# EAGLE design Chime PCB (EAGLE 9.6.2)
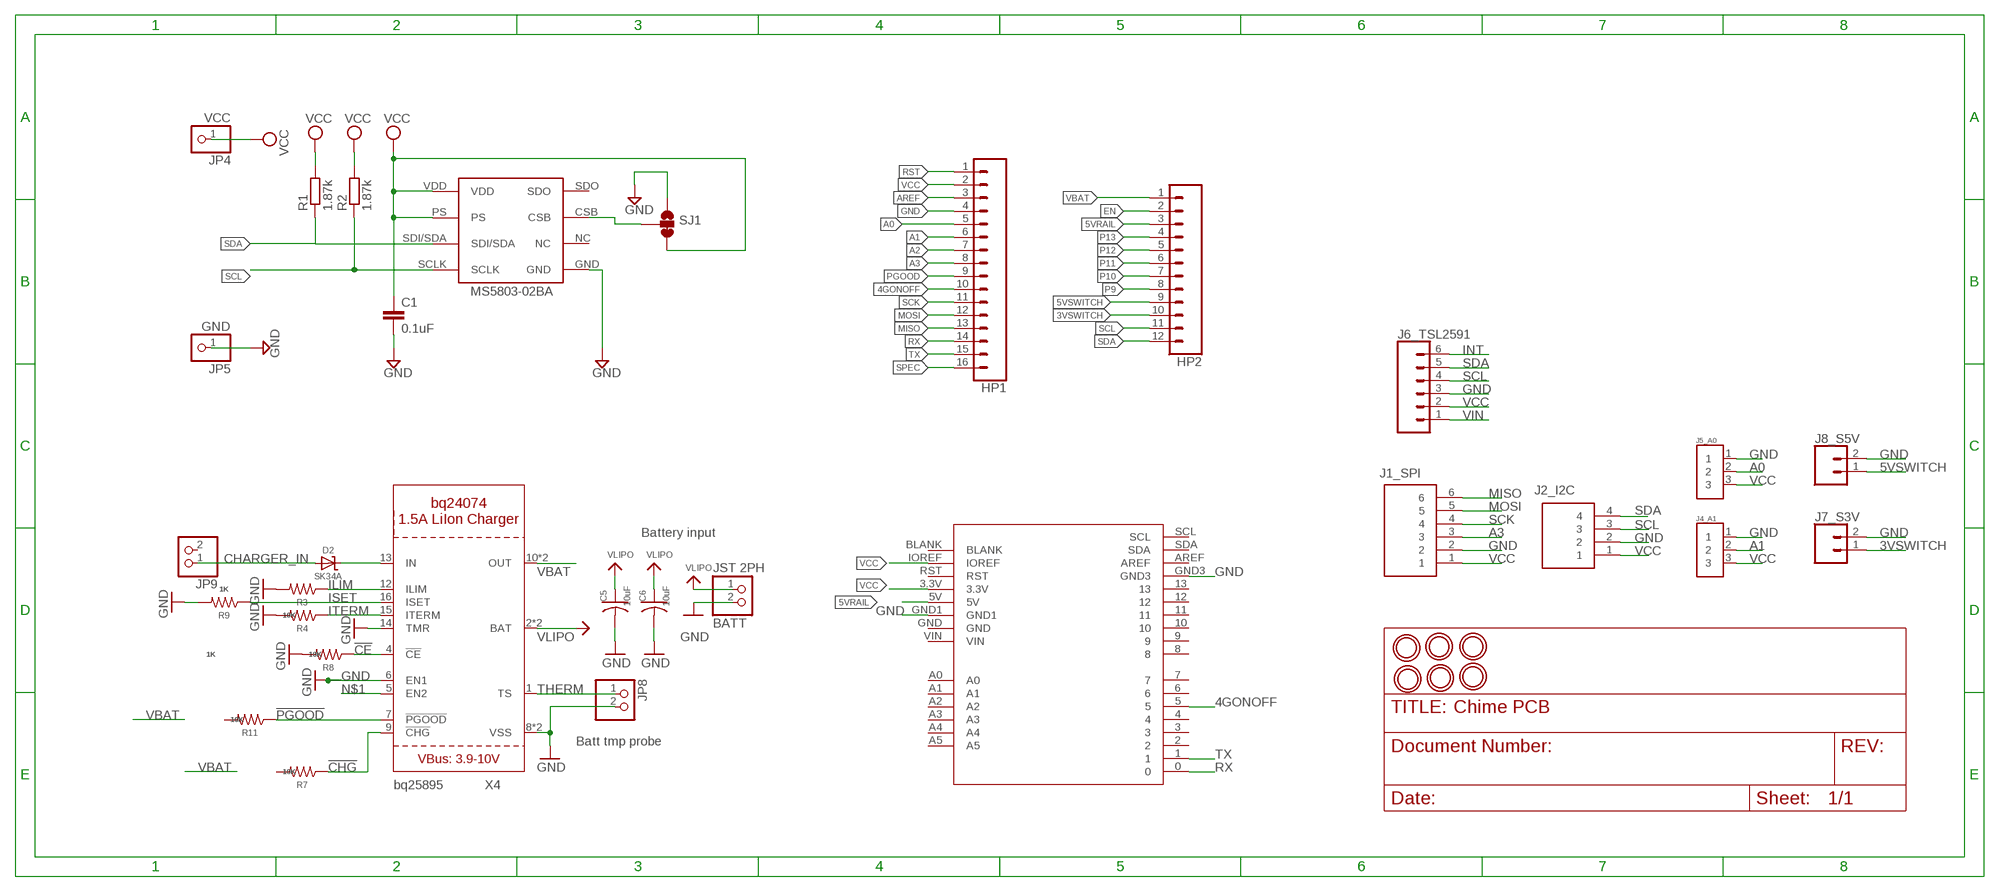
[diagram p0: schematic, sheet 1]

## Parts
BATT  JST 2PH  JST_2PIN-SMT-RA  [JST-PH-2-SMT-RA]
C1  0.1uF  C-EUC0805  [C0805]
C5  10uF  C-USC0805K  [C0805K]
C6  10uF  C-USC0805K  [C0805K]
D2  SK34A  DIODE-SCHOTTKYSMA  [SMADIODE]
HP1  CONN_16  [1X16]
HP2  CONN_12  [1X12]
J1_SPI  1725698  [1725698]
J2_I2C  1725672  [1725672]
J4_A1  282834-3  [TE_282834-3]
J5_A0  282834-3  [TE_282834-3]
J6_TSL2591  CONN_06LOCK  [1X06_LOCK]
J7_S3V  CONN_02  [1X02]
J8_S5V  CONN_02  [1X02]
JP4  VCC  PINHD-1X1  [1X01]
JP5  GND  PINHD-1X1  [1X01]
JP8  PINHD-1X2  [1X02]
JP9  PINHD-1X2  [1X02]
R1  1.87k  R-EU_R0805  [R0805]
R2  1.87k  R-EU_R0805  [R0805]
R3  1K  R-US_M0805  [M0805]
R4  10K  R-US_M0805  [M0805]
R7  10K  R-US_M0805  [M0805]
R8  10K  R-US_M0805  [M0805]
R9  1K  R-US_M0805  [M0805]
R11  10K  R-US_M0805  [M0805]
SJ1  JUMPER-SMT_3_1-NC_TRACE_SILK  [SMT-JUMPER_3_1-NC_TRACE_SILK]
U1  MS5803-02BA  [MS5803-02BA]
U$1  LTE_BOARD  [LTE_BOARD_FOOTPRINT]
U$2  MOUNTINGHOLE2.5  [MOUNTINGHOLE_2.5_PLATED]
U$3  MOUNTINGHOLE2.5  [MOUNTINGHOLE_2.5_PLATED]
U$4  MOUNTINGHOLE2.5  [MOUNTINGHOLE_2.5_PLATED]
U$5  MOUNTINGHOLE2.5  [MOUNTINGHOLE_2.5_PLATED]
U$17  MOUNTINGHOLE2.5  [MOUNTINGHOLE_2.5_PLATED]
U$19  MOUNTINGHOLE2.5  [MOUNTINGHOLE_2.5_PLATED]
X4  BQ24074  [QFN16_3MM]

## Nets
3VSWITCH: HP2.10 J7_S3V.1
4GONOFF: HP1.10 U$1.5
5VRAIL: HP2.3 U$1.5V
5VSWITCH: HP2.9 J8_S5V.1
!CE: R8.1 X4.4(!CE)
!CHG: R7.1 X4.9(!CHG)
!PGOOD: R11.1 X4.7(!PGOOD)
A0: HP1.5 J5_A0.2
A1: HP1.6 J4_A1.2
A2: HP1.7
A3: HP1.8 J1_SPI.3
AREF: HP1.3
CHARGER_IN: D2.A JP9.1
EN: HP2.2
GND: BATT.2 C1.2 C5.2 C6.2 HP1.4 J1_SPI.2 J2_I2C.2 J4_A1.1 J5_A0.1 J6_TSL2591.3 J7_S3V.2 J8_S5V.2 JP5.1 JP8.2 R3.2 R4.2 R8.2 R9.2 SJ1.1 U1.GND U$1.GND1 U$1.GND3 X4.6(EN1) X4.8(VSS) X4.14(TMR) X4.THERMAL(VSS)
ILIM: R3.1 X4.12(ILIM)
INT: J6_TSL2591.6
ISET: R9.1 X4.16(ISET)
ITERM: R4.1 X4.15(ITERM)
MISO: HP1.13 J1_SPI.6
MOSI: HP1.12 J1_SPI.5
N$1: X4.5(EN2)
N$2: D2.C X4.13(IN)
N$3: SJ1.2 U1.CSB
P9: HP2.8
P10: HP2.7
P11: HP2.6
P12: HP2.5
P13: HP2.4
PGOOD: HP1.9
RST: HP1.1
RX: HP1.14 U$1.0
SCK: HP1.11 J1_SPI.4
SCL: HP2.11 J2_I2C.3 J6_TSL2591.4 R2.1 U1.SCLK
SDA: HP2.12 J2_I2C.4 J6_TSL2591.5 R1.1 U1.SDI/SDA
SPEC: HP1.16
THERM: JP8.1 X4.1(TS)
TX: HP1.15 U$1.1
VBAT: HP2.1 X4.10(OUT) X4.11(OUT)
VCC: C1.1 HP1.2 J1_SPI.1 J2_I2C.1 J4_A1.3 J5_A0.3 J6_TSL2591.2 JP4.1 R1.2 R2.2 SJ1.3 U1.PS U1.VDD U$1.3.3V U$1.IOREF
VIN: J6_TSL2591.1
VLIPO: BATT.1 C5.1 C6.1 X4.2(BAT) X4.3(BAT)
Unconnected: JP9.2 R7.2 R11.2 U1.NC U1.SDO U$1.2 U$1.3 U$1.4 U$1.6 U$1.7 U$1.8 U$1.9 U$1.10 U$1.11 U$1.12 U$1.13 U$1.A0 U$1.A1 U$1.A2 U$1.A3 U$1.A4 U$1.A5 U$1.AREF U$1.BLANK U$1.GND U$1.RST U$1.SCL U$1.SDA U$1.VIN

## Notes on the sheet
- Battery input
- Batt tmp probe

## Library data of the parts
BATT = adafruit:JST_2PIN: JST 2-Pin Connectors of various flavors SMT-RA (S2B-PH-SM4) 4UConnector #17311 SMT (B2B-PH-SM4) THM-RA (S2B-PH) THM (B2B-PH)
C1 = rcl:C-EU: CAPACITOR, European symbol; SPICEPREFIX: C
C5 C6 = adafruit:C-US: CAPACITOR, American symbol
D2 = microbuilder:DIODE-SCHOTTKY
HP1 = SparkFun-Connectors:CONN_16: Multi connection point. Often used as Generic Header-pin footprint for 0.1 inch spaced/style header connections On any of the 0.1 inch spaced packages, you can populate with these: Break Away Headers - Straight <https://www.sparkfun.com/products/116> (PRT-00116) Break Away Male Headers - Right Angle <https://www.sparkfun.com/products/553> (PRT-00553) Female Headers <https://www.sparkfun.com/products/115> (PRT-00115) Break Away Headers - Machine Pin <https://www.sparkfun.com/products/117> (PRT-00117) Break Away Female Headers - Swiss Machine Pin <https://www.sparkfun.com/products/743> (PRT-00743) For SCREWTERMINALS and SPRING TERMINALS visit here: Screw Terimnals on SparkFun.com <https://www.sparkfun.com/search/results?term=Screw+Terminals> (5mm/3.5mm/2.54mm spacing) This device is also useful as a general connection point to wire up your design to another part of your project. Our various solder wires solder well into these plated through hole pads. Hook-Up Wire - Assortment (Stranded, 22 AWG) <https://www.sparkfun.com/products/11375> (PRT-11375) Hook-Up Wire - Assortment (Solid Core, 22 AWG) <https://www.sparkfun.com/products/11367> (PRT-11367) View the entire wire category on our website here <https://www.sparkfun.com/categories/141> Special notes: Molex polarized connector foot print use with SKU : PRT-08231 with associated crimp pins and housings. 1MM SMD Version SKU: PRT-10208 NOTES ON THE VARIANTS LOCK and LOCK_LONGPADS... This footprint was designed to help hold the alignment of a through-hole component (i.e. 6-pin header) while soldering it into place. You may notice that each hole has been shifted either up or down by 0.005 of an inch from it's more standard position (which is a perfectly straight line). This slight alteration caused the pins (the squares in the middle) to touch the edges of the holes. Because they are alternating, it causes a "brace" to hold the component in place. 0.005 has proven to be the perfect amount of "off-center" position when using our standard breakaway headers. Although looks a little odd when you look at the bare footprint, once you have a header in there, the alteration is very hard to notice. Also,if you push a header all the way into place, it is covered up entirely on the bottom side.
HP2 = SparkFun-Connectors:CONN_12: Multi connection point. Often used as Generic Header-pin footprint for 0.1 inch spaced/style header connections On any of the 0.1 inch spaced packages, you can populate with these: Break Away Headers - Straight <https://www.sparkfun.com/products/116> (PRT-00116) Break Away Male Headers - Right Angle <https://www.sparkfun.com/products/553> (PRT-00553) Female Headers <https://www.sparkfun.com/products/115> (PRT-00115) Break Away Headers - Machine Pin <https://www.sparkfun.com/products/117> (PRT-00117) Break Away Female Headers - Swiss Machine Pin <https://www.sparkfun.com/products/743> (PRT-00743) For SCREWTERMINALS and SPRING TERMINALS visit here: Screw Terimnals on SparkFun.com <https://www.sparkfun.com/search/results?term=Screw+Terminals> (5mm/3.5mm/2.54mm spacing) This device is also useful as a general connection point to wire up your design to another part of your project. Our various solder wires solder well into these plated through hole pads. Hook-Up Wire - Assortment (Stranded, 22 AWG) <https://www.sparkfun.com/products/11375> (PRT-11375) Hook-Up Wire - Assortment (Solid Core, 22 AWG) <https://www.sparkfun.com/products/11367> (PRT-11367) View the entire wire category on our website here <https://www.sparkfun.com/categories/141> Special notes: Molex polarized connector foot print use with SKU : PRT-08231 with associated crimp pins and housings. 1MM SMD Version SKU: PRT-10208 NOTES ON THE VARIANTS LOCK and LOCK_LONGPADS... This footprint was designed to help hold the alignment of a through-hole component (i.e. 6-pin header) while soldering it into place. You may notice that each hole has been shifted either up or down by 0.005 of an inch from it's more standard position (which is a perfectly straight line). This slight alteration caused the pins (the squares in the middle) to touch the edges of the holes. Because they are alternating, it causes a "brace" to hold the component in place. 0.005 has proven to be the perfect amount of "off-center" position when using our standard breakaway headers. Although looks a little odd when you look at the bare footprint, once you have a header in there, the alteration is very hard to notice. Also,if you push a header all the way into place, it is covered up entirely on the bottom side.
J1_SPI = 1725698:1725698: Conn PC Terminal Block 6 POS 2.54mm Solder ST Thru-Hole 6A Source: Datasheet <https://www.phoenixcontact.com/online/portal/us/pxc/product_detail_page/!ut/p/z1/5Vddc6IwFP0r7oNvxYSPBHhEdNda6-KKW-GFISE6tHwVUmn76zeonY7dVmfH8WEH5s6QhHtv7jnJYeYCHyyBn4WbeB3yOM_CRMw9Hwdu3x0OHQXLP2eoD68HyB5OtF_yaKqA38AHfsUSRjmL7JCzdV6-AM-aTJoPPCTAk5tRQekD8B>; ARROW_PART_NUMBER: 1725698; ARROW_PRICE-STOCK: https://www.arrow.com/en/products/1725698/phoenix-contact?region=nac; DESCRIPTION: Conn PC Terminal Block 6 POS 2.54mm Solder ST Thru-Hole 6A; HEIGHT: 8.65mm; MANUFACTURER_NAME: Phoenix Contact; MANUFACTURER_PART_NUMBER: 1725698; MOUSER_PART_NUMBER: 651-1725698; MOUSER_PRICE-STOCK: https://www.mouser.co.uk/ProductDetail/Phoenix-Contact/1725698?qs=Ul7CXFMnlWUIR3VpVwwC4A%3D%3D
J2_I2C = 1725672:1725672: 4 way vertical PCB terminal,6A 63V Phoenix Contact Non-Fused Terminal Block, 4 Way, Solder Terminals, 26 ??? 20 AWG Through Hole, Nylon, 63 V Source: Datasheet <https://datasheet.datasheetarchive.com/originals/distributors/SFDatasheet-2/sf-00050602.pdf>; ARROW_PART_NUMBER: 1725672; ARROW_PRICE-STOCK: https://www.arrow.com/en/products/1725672/phoenix-contact?region=nac; DESCRIPTION: 4 way vertical PCB terminal,6A 63V Phoenix Contact Non-Fused Terminal Block, 4 Way, Solder Terminals, 26 ??? 20 AWG Through Hole, Nylon, 63 V; HEIGHT: 8.65mm; MANUFACTURER_NAME: Phoenix Contact; MANUFACTURER_PART_NUMBER: 1725672; MOUSER_PART_NUMBER: 651-1725672; MOUSER_PRICE-STOCK: https://www.mouser.co.uk/ProductDetail/Phoenix-Contact/1725672?qs=Ul7CXFMnlWXX93F9bOV2pQ%3D%3D
J4_A1 J5_A0 = Fixed Terminal Blocks 3P:282834-3: Conn; Term Blk; PCB; Wire Receptacle; 3; 2.54mm; 30-16AWG; Green; 10A; 150V; M1.6 Check availability <https://pricing.snapeda.com/parts/282834-3/TE%20Connectivity/view-part?ref=eda>; AVAILABILITY: In Stock; COMMENT: 282834-3; DESCRIPTION: 3 Position Wire to Board Terminal Block Horizontal with Board 0.100 (2.54mm); EU_ROHS_COMPLIANCE: Compliant with Exemptions; MF: TE Connectivity; MP: 282834-3; PACKAGE: None; PRICE: None; PURCHASE-URL: https://pricing.snapeda.com/search/part/282834-3/?ref=eda
J6_TSL2591 = SparkFun-Connectors:CONN_06: Multi connection point. Often used as Generic Header-pin footprint for 0.1 inch spaced/style header connections On any of the 0.1 inch spaced packages, you can populate with these: Break Away Headers - Straight <https://www.sparkfun.com/products/116> (PRT-00116) Break Away Male Headers - Right Angle <https://www.sparkfun.com/products/553> (PRT-00553) Female Headers <https://www.sparkfun.com/products/115> (PRT-00115) Break Away Headers - Machine Pin <https://www.sparkfun.com/products/117> (PRT-00117) Break Away Female Headers - Swiss Machine Pin <https://www.sparkfun.com/products/743> (PRT-00743) Arduino Stackable Header - 6 Pin <https://www.sparkfun.com/products/9280> (PRT-09280) Screw Terminals 2.54mm Pitch (6-Pin) <https://www.sparkfun.com/products/16499> (PRT-16499) For SCREWTERMINALS and SPRING TERMINALS visit here: Screw Terimnals on SparkFun.com <https://www.sparkfun.com/search/results?term=Screw+Terminals> (5mm/3.5mm/2.54mm spacing) This device is also useful as a general connection point to wire up your design to another part of your project. Our various solder wires solder well into these plated through hole pads. Hook-Up Wire - Assortment (Stranded, 22 AWG) <https://www.sparkfun.com/products/11375> (PRT-11375) Hook-Up Wire - Assortment (Solid Core, 22 AWG) <https://www.sparkfun.com/products/11367> (PRT-11367) View the entire wire category on our website here <https://www.sparkfun.com/categories/141>
J7_S3V J8_S5V = SparkFun-Connectors:CONN_02: Multi connection point. Often used as Generic Header-pin footprint for 0.1 inch spaced/style header connections On any of the 0.1 inch spaced packages, you can populate with these: Break Away Headers - Straight <https://www.sparkfun.com/products/116> (PRT-00116) Break Away Male Headers - Right Angle <https://www.sparkfun.com/products/553> (PRT-00553) Female Headers <https://www.sparkfun.com/products/115> (PRT-00115) Break Away Headers - Machine Pin <https://www.sparkfun.com/products/117> (PRT-00117) Break Away Female Headers - Swiss Machine Pin <https://www.sparkfun.com/products/743> (PRT-00743) For SCREWTERMINALS and SPRING TERMINALS visit here: Screw Terimnals on SparkFun.com <https://www.sparkfun.com/search/results?term=Screw+Terminals> (5mm/3.5mm/2.54mm spacing) This device is also useful as a general connection point to wire up your design to another part of your project. Our various solder wires solder well into these plated through hole pads. Hook-Up Wire - Assortment (Stranded, 22 AWG) <https://www.sparkfun.com/products/11375> (PRT-11375) Hook-Up Wire - Assortment (Solid Core, 22 AWG) <https://www.sparkfun.com/products/11367> (PRT-11367) View the entire wire category on our website here <https://www.sparkfun.com/categories/141> Special notes: Molex polarized connector foot print use with: PRT-08233 with associated crimp pins and housings. 2.54_SCREWTERM for use with PRT-10571. 3.5mm Screw Terminal footprints for PRT-08084 5mm Screw Terminal footprints for use with PRT-08432
JP4 JP5 = pinhead_simple:PINHD-1X1: PIN HEADER
JP8 JP9 = pinhead:PINHD-1X2: PIN HEADER
R1 R2 = rcl:R-EU_: RESISTOR, European symbol; SPICEPREFIX: R
R3 R4 R7-R9 R11 = adafruit:R-US_: RESISTOR, American symbol
SJ1 = SparkFun-Jumpers:JUMPER-SMT_3_1-NC_TRACE: Normally closed trace jumper (1 of 2 connections) This jumper has a trace between two pads so it's normally closed (NC). The other connection is normally open (NO). Use a razor knife to open the connection. For best results follow the IPC guidelines for cutting traces: Cutout at least 0.063 mm (0.005 in). Remove all loose material to clean up the cut area. Seal the cut with an approved epoxy. Reapply solder to reclose the connection, or to close the NO connection.
U1 = PNNL_Probe:MS5803-02BA
U$1 = LTE_BOARD_LOOM:LTE_BOARD: LTE_BOARD
U$2-U$5 U$17 U$19 = microbuilder:MOUNTINGHOLE: Mounting Hole For #2 screws (0.086"/2.18mm width, 0.094"/2.4mm hole) use 2.5mm; BOM: EXCLUDE
X4 = adafruit_power:BQ24074

## Board
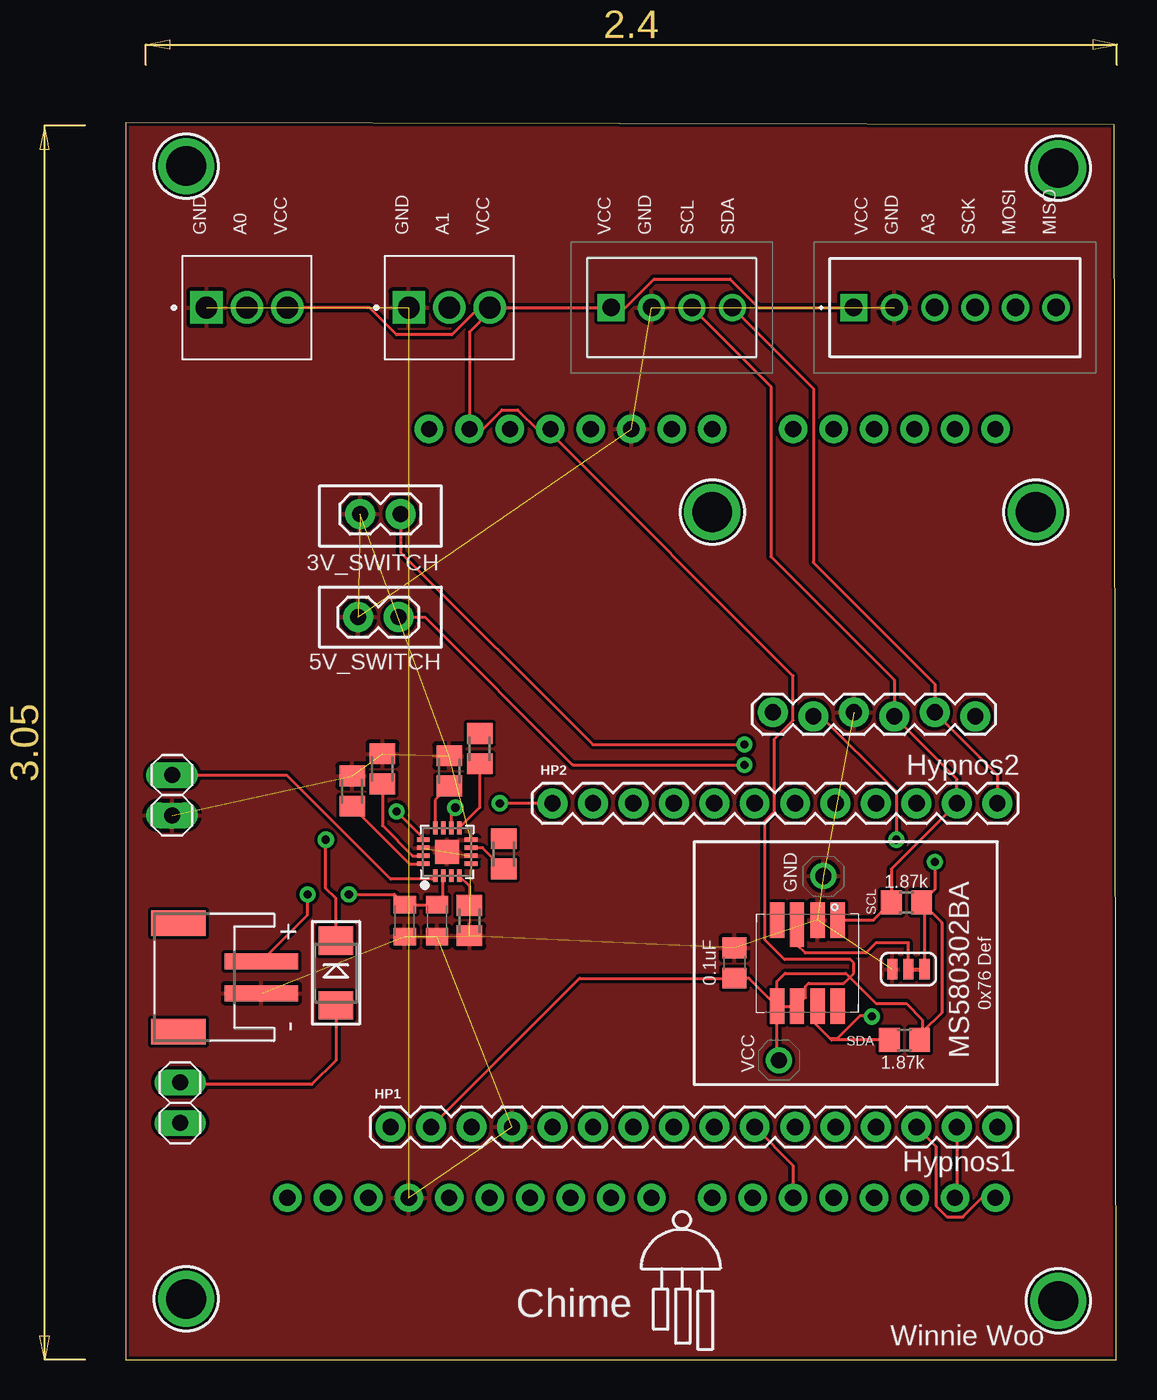
[diagram p1: board, top side]
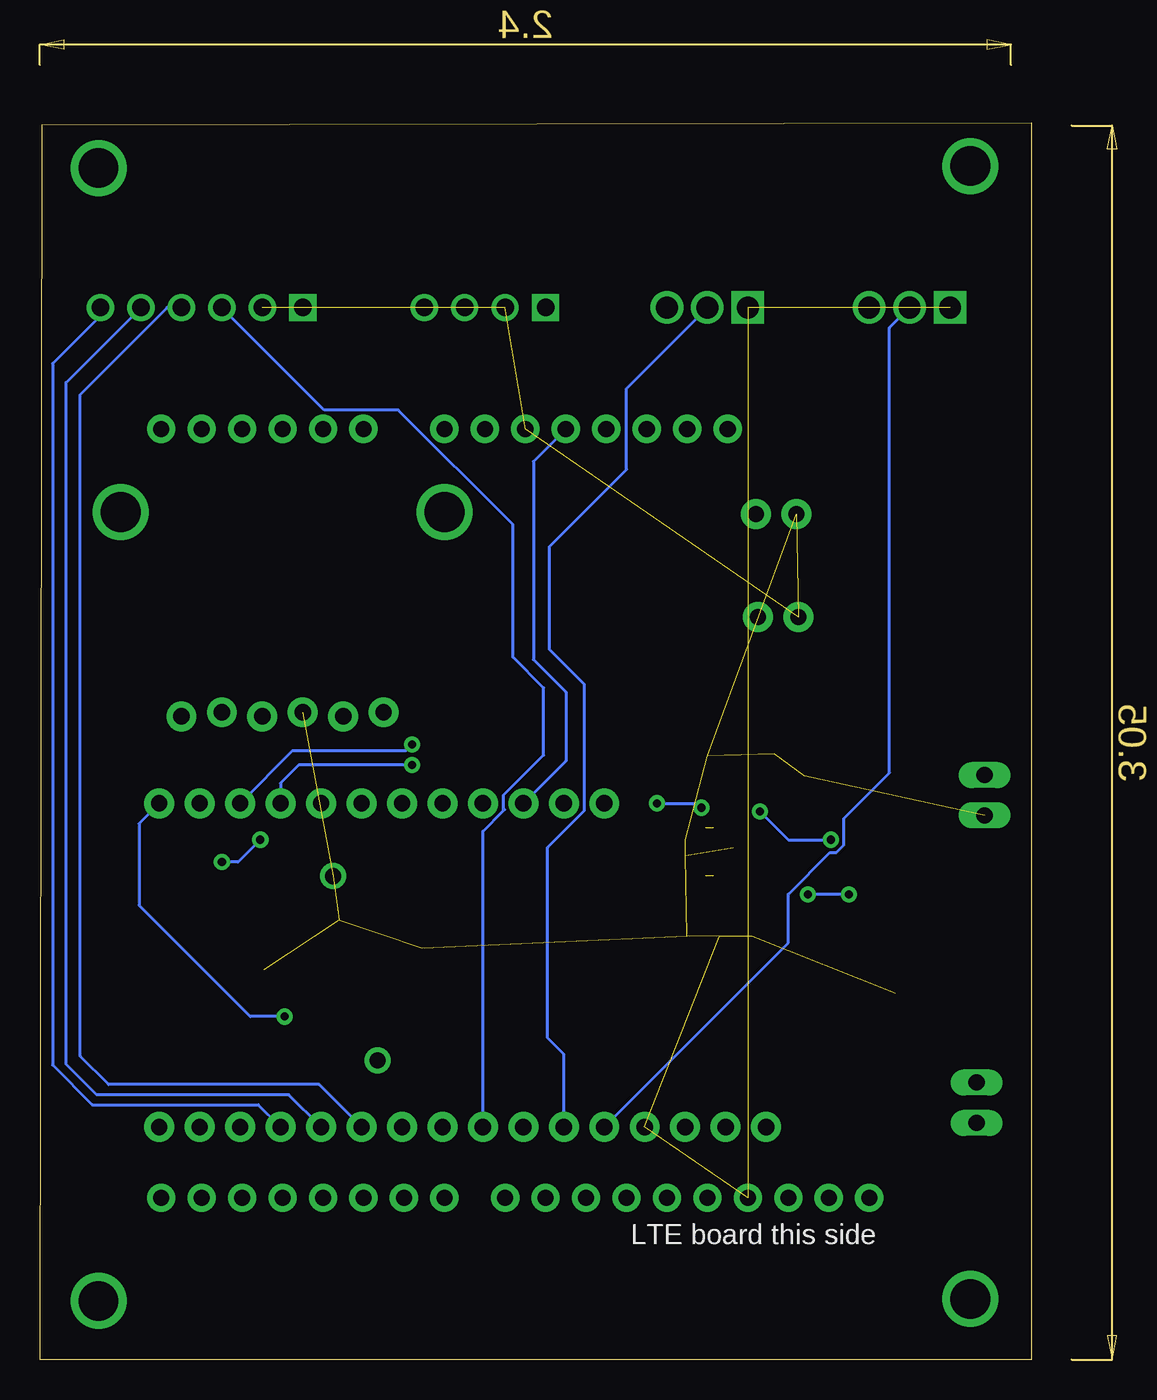
[diagram p2: board, bottom side, seen from below]

Size 62.21 x 77.65 mm. Coordinates in mm from the lower left corner, seen from the top.
Outline: 0,0 62.21,0 62.08,77.52 0,77.65 0,0
Copper layers (1*16): Top 0.035mm / dielectric 1.5mm / Bottom 0.035mm
Design rules "SparkFun": minimum track width 8mil, minimum drill 20mil, track to track 8mil, track to pad 8mil, pad to pad 8mil, via to via 8mil, smd to smd 8mil, copper to edge 8mil, drill to drill 8mil, minimum pad ring 12mil, minimum via ring 10mil, stop-mask expansion 4mil, vias tented up to drill 20mil, thermal gap 10mil

### Footprints (pad centres in the part's own frame; a part is rotated, then mirrored left to right if it is on the bottom)
JST-PH-2-SMT-RA = smd 1 x 4.6: 1 1,-3.7; 2 -1,-3.7 | smd 1.6 x 3.4: NC1 -3.4,1.5; NC2 3.4,1.5
C0805 = smd 1.3 x 1.5: 1 -0.95,0; 2 0.95,0
C0805K = smd 1.1 x 1.4: 1 -1,0; 2 1,0
SMADIODE = smd 1.778 x 2.159: A 2.019,0; C -2.045,0
1X16 = drill 1.016 pad 1.88: 1 0,0; 2 2.54,0; 3 5.08,0; 4 7.62,0; 5 10.16,0; 6 12.7,0; 7 15.24,0; 8 17.78,0; 9 20.32,0; 10 22.86,0; 11 25.4,0; 12 27.94,0; 13 30.48,0; 14 33.02,0; 15 35.56,0; 16 38.1,0
1X12 = drill 1.016 pad 1.88: 1 0,0; 2 2.54,0; 3 5.08,0; 4 7.62,0; 5 10.16,0; 6 12.7,0; 7 15.24,0; 8 17.78,0; 9 20.32,0; 10 22.86,0; 11 25.4,0; 12 27.94,0
1725698 = drill 1.1 pad 1.65 square: 1 0,0 | drill 1.1 pad 1.65: 2 2.54,0; 3 5.08,0; 4 7.62,0; 5 10.16,0; 6 12.7,0
1725672 = drill 1.1 pad 1.65 square: 1 0,0 | drill 1.1 pad 1.65: 2 2.54,0; 3 5.08,0; 4 7.62,0
TE_282834-3 = drill 1.36 square: 1 0,0 | drill 1.36: 2 2.54,0; 3 5.08,0
1X06_LOCK = drill 1.016 pad 1.88: 1 0,0; 2 2.54,-0.254; 3 5.08,0; 4 7.62,-0.254; 5 10.16,0; 6 12.7,-0.254
1X02 = drill 1.016 pad 1.88: 1 0,0; 2 2.54,0
1X01 = drill 1.016: 1 0,0
1X02' = drill 1.016 long: 1 -1.27,0; 2 1.27,0
R0805 = smd 1.3 x 1.5: 1 -0.95,0; 2 0.95,0
M0805 = smd 1.3 x 1.6: 1 -0.95,0; 2 0.95,0
SMT-JUMPER_3_1-NC_TRACE_SILK = smd 0.635 x 1.27: 1 -1.016,0; 2 0,0; 3 1.016,0
MS5803-02BA = smd 2.8 x 0.9: CSB 2.42,0.65 | smd 2.25 x 0.9: GND 2.7,-0.65; NC 2.7,1.9; PS -2.7,0.65; SCLK 2.7,-1.9; SDI/SDA -2.7,-0.65; SDO -2.7,-1.9; VDD -2.7,1.9
LTE_BOARD_FOOTPRINT = drill 1.016 pad 1.778: 0 35.56,48.26; 1 33.02,48.26; 2 30.48,48.26; 3 27.94,48.26; 3.3V 7.62,0; 4 25.4,48.26; 5 22.86,48.26; 5V 10.16,0; 6 20.32,48.26; 7 17.78,48.26; 8 13.97,48.26; 9 11.43,48.26; 10 8.89,48.26; 11 6.35,48.26; 12 3.81,48.26; 13 1.27,48.26; A0 22.86,0; A1 25.4,0; A2 27.94,0; A3 30.48,0; A4 33.02,0; A5 35.56,0; AREF -3.81,48.26; BLANK 0,0; GND 15.24,0; GND1 12.7,0; GND3 -1.27,48.26; IOREF 2.54,0; RST 5.08,0; SCL -8.89,48.26; SDA -6.35,48.26; VIN 17.78,0
MOUNTINGHOLE_2.5_PLATED = drill 2.5 pad 3.2: P$1 0,0
QFN16_3MM = smd 0.8 x 0.28: 1 -1.5,0.75; 2 -1.5,0.25; 3 -1.5,-0.25; 4 -1.5,-0.75; 9 1.5,-0.75; 10 1.5,-0.25; 11 1.5,0.25; 12 1.5,0.75 | smd 0.28 x 0.8: 5 -0.75,-1.5; 6 -0.25,-1.5; 7 0.25,-1.5; 8 0.75,-1.5; 13 0.75,1.5; 14 0.25,1.5; 15 -0.25,1.5; 16 -0.75,1.5 | smd 1.5 x 1.5: THERMAL 0,0

### Placement (x,y rotation side)
BATT  4.83,24 90 top
C1  38.23,24.89 90 top
C5  19.56,27.56 270 top
C6  17.53,27.56 270 top
D2  13.21,24.26 270 top
HP1  16.64,14.61 0 top
HP2  26.8,34.92 0 top
J1_SPI  45.72,66.04 0 top
J2_I2C  30.48,66.04 0 top
J4_A1  17.78,66.04 0 top
J5_A0  5.08,66.04 0 top
J6_TSL2591  40.64,40.64 0 top
J7_S3V  17.27,53.09 180 top
J8_S5V  17.14,46.61 180 top
JP4  41.02,18.8 90 top
JP5  43.81,30.35 90 top
JP8  [1X02']  2.92,35.43 270 top
JP9  [1X02']  3.43,16.13 270 top
R1  48.9,20.07 0 top
R2  49.02,28.7 0 top
R3  20.32,36.96 90 top
R4  16.13,37.08 90 top
R7  22.23,38.35 90 top
R8  21.59,27.56 270 top
R9  14.22,35.69 90 top
R11  23.75,31.75 90 top
SJ1  49.15,24.51 0 top
U1  42.8,24.89 90 top
U$1  19.05,58.42 180 bottom
U$2  3.81,3.81 0 top
U$3  3.81,74.93 0 top
U$4  58.55,74.8 0 top
U$5  58.55,3.68 0 top
U$17  57.15,53.21 0 top
U$19  36.83,53.21 0 top
X4  20.19,31.88 90 top

### Tracks (layer width: path | path; a pad name or v marks a point on that pad's centre or on a via)
3VSWITCH  (via drill 0.51)
  Top 0.203: J7_S3V.1 17.27,50.67 29.34,38.61 v38.86,38.61
  Bottom 0.203: v38.86,38.61 39.24,38.23 46.35,38.23 HP2.10
4GONOFF
  Top 0.203: HP1.10 41.91,12.19 U$1.5
5VRAIL
  Bottom 0.203: HP2.3 29.21,37.59 29.21,41.91 31.24,43.94 31.24,56.39 U$1.5V
5VSWITCH  (via drill 0.51)
  Top 0.203: J8_S5V.1 18.8,46.61 28.07,37.34 v38.86,37.34
  Bottom 0.203: v38.86,37.34 45.97,37.34 47.12,36.2 HP2.9
!CE
  Top 0.203: X4.4 21.59,29.73 R8.1
!CHG
  Top 0.203: R7.1 22.23,34.66 X4.9
!PGOOD
  Top 0.203: R11.1 22.42,32.13 X4.7
A0
  Bottom 0.203: J5_A0.2 8.89,64.77 8.89,36.83 11.76,33.96 11.76,32.3 12.24,31.83 12.62,31.83 15.24,29.21 15.24,26.16 HP1.5
A1
  Bottom 0.203: J4_A1.2 25.4,60.96 25.4,55.88 30.23,51.05 30.23,44.58 28.04,42.39 28.04,34.46 30.35,32.15 30.35,20.19 29.34,19.18 HP1.6
A3
  Bottom 0.203: HP1.8 34.42,33.16 33.12,34.46 | J1_SPI.3 44.37,59.61 39.73,59.61 32.54,52.42 32.54,44.09 30.61,42.16 30.61,37.95 33.12,35.44 33.12,34.46 | 33.12,34.46 33.05,34.54
CHARGER_IN
  Top 0.203: JP9.1 3.56,17.27 11.68,17.27 13.21,18.8 D2.A
GND  (25 unrouted)
  pour Top: 0,77.47 62.23,77.47 62.23,0 0,0
ILIM
  Top 0.203: R3.1 19.44,35.13 X4.12
ISET
  Top 0.203: R9.1 17.83,31.13 X4.16
ITERM
  Top 0.203: R4.1 16.13,33.53 18.04,31.63 X4.15
MISO
  Bottom 0.203: J1_SPI.6 58.42,65.53 61.43,62.52 61.43,18.5 58.93,16 48.51,16 HP1.13
MOSI
  Bottom 0.203: HP1.12 46.61,16.64 58.67,16.64 60.58,18.54 60.58,61.34 J1_SPI.5
N$2  (via drill 0.51)
  Top 0.203: v17.02,34.42 18.69,32.74 X4.13 | D2.C 13.21,28.96 12.57,29.59 v12.57,32.64
  Bottom 0.203: v17.02,34.42 15.24,32.64 v12.57,32.64
N$3
  Top 0.203: U1.CSB 42.15,26.05 42.67,25.53 46.48,25.53 47.12,26.16 49.15,26.16 SJ1.2
RX
  Top 0.203: HP1.14 50.88,13.39 50.88,9.67 51.58,8.97 52.56,8.97 53.76,10.16 U$1.0
SCK
  Bottom 0.203: HP1.11 44.7,17.27 57.91,17.27 59.69,19.05 59.69,60.59 54.24,66.04 J1_SPI.4
SCL
  Top 0.203: U1.SCLK 46.96,27.59 R2.1 48.07,30.8 HP2.11 52.2,36.45 J6_TSL2591.4 48.26,42.65 40.51,50.4 40.51,61.09 J2_I2C.3
SDA  (via drill 0.51)
  Top 0.203: 44.26,20.13 44.32,20.07 R1.1 48.01,20 | 44.26,20.13 43.31,21.08 43.31,22.05 U1.SDI/SDA | v46.86,21.54 46.81,21.59 46.1,21.59 44.64,20.13 44.26,20.13 | J2_I2C.4 43.18,60.96 43.18,50.04 50.8,42.42 J6_TSL2591.5 54.74,36.7 HP2.12
  Bottom 0.203: v46.86,21.54 49.02,21.54 56.01,28.52 56.01,33.66 HP2.12
THERM
  Top 0.203: JP8.1 10.12,36.7 16.65,30.17 19.24,30.17 X4.1
TX
  Top 0.203: HP1.15 52.2,10.29 U$1.1
VBAT  (via drill 0.51)  (1 unrouted)
  Top 0.203: HP2.1 v23.5,34.92 | v20.7,34.65 20.44,34.39 X4.10
  Bottom 0.203: v23.5,34.92 23.47,34.9 20.95,34.9 v20.7,34.65
VCC  (via drill 0.51)
  Top 0.203: 40.89,18.92 JP4.1 40.9,18.92 U1.VDD | U1.VDD | U1.VDD U1.PS 42.69,22.74 42.69,23.44 42.87,23.62 45.09,23.62 45.72,24.26 45.72,24.91 45.51,25.12 41.36,25.12 40.14,26.34 40.14,33.81 40.74,34.41 40.74,38.96 41.91,40.13 41.91,42.93 26.67,58.17 U$1.3.3V 25.82,58.42 24.62,59.61 23.64,59.61 22.44,58.42 U$1.IOREF 21.59,64.52 22.86,65.79 J4_A1.3 | U1.VDD 39.15,23.94 C1.1 28.51,23.94 HP1.2 | 49.78,28.51 49.94,28.67 | 49.94,28.67 R2.2 | U1.VDD 40.9,23.75 41.4,24.26 45.21,24.26 47.12,22.35 49.01,22.35 50.04,21.32 50.04,20.57 | R1.2 49.78,20.13 49.78,20.32 50.04,20.57 | SJ1.3 50.16,28.45 49.94,28.67 | 50.04,20.57 51.24,21.78 51.24,27.43 R2.2 | J1_SPI.1 39.74,66.04 37.95,67.83 33.17,67.83 31.38,66.04 J2_I2C.1 J4_A1.3 | J4_A1.3 22.19,66.04 20.49,64.33 17.02,64.33 15.31,66.04 J5_A0.3 | J6_TSL2591.2 43.42,40.62 43.42,40.64 48.39,35.67 v48.39,32.64 | v50.8,31.24 50.8,29.53 R2.2
  Bottom 0.203: v48.39,32.64 49.78,31.24 v50.8,31.24
VLIPO  (via drill 0.51)  (1 unrouted)
  Top 0.203: X4.2 19.94,28.94 C5.1 C6.1 16.88,29.21 v14.02,29.21 | BATT.1 11.43,27.91 v11.43,29.21
  Bottom 0.203: v11.43,29.21 v14.02,29.21

### Text on the board
tPlace: GND | A0 | VCC | GND | A1 | VCC | VCC | GND | SCL | SDA | VCC | GND | A3 | SCK | MOSI | MISO | 3V_SWITCH | 5V_SWITCH | Hypnos2 | 1.87k | GND | SCL | 0.1uF | 0x76 Def | SDA | 1.87k | MS580302BA | VCC | Hypnos1 | Chime | Winnie Woo
bNames: LTE board this side